# EAGLE design rj11 (EAGLE 7.7.0)
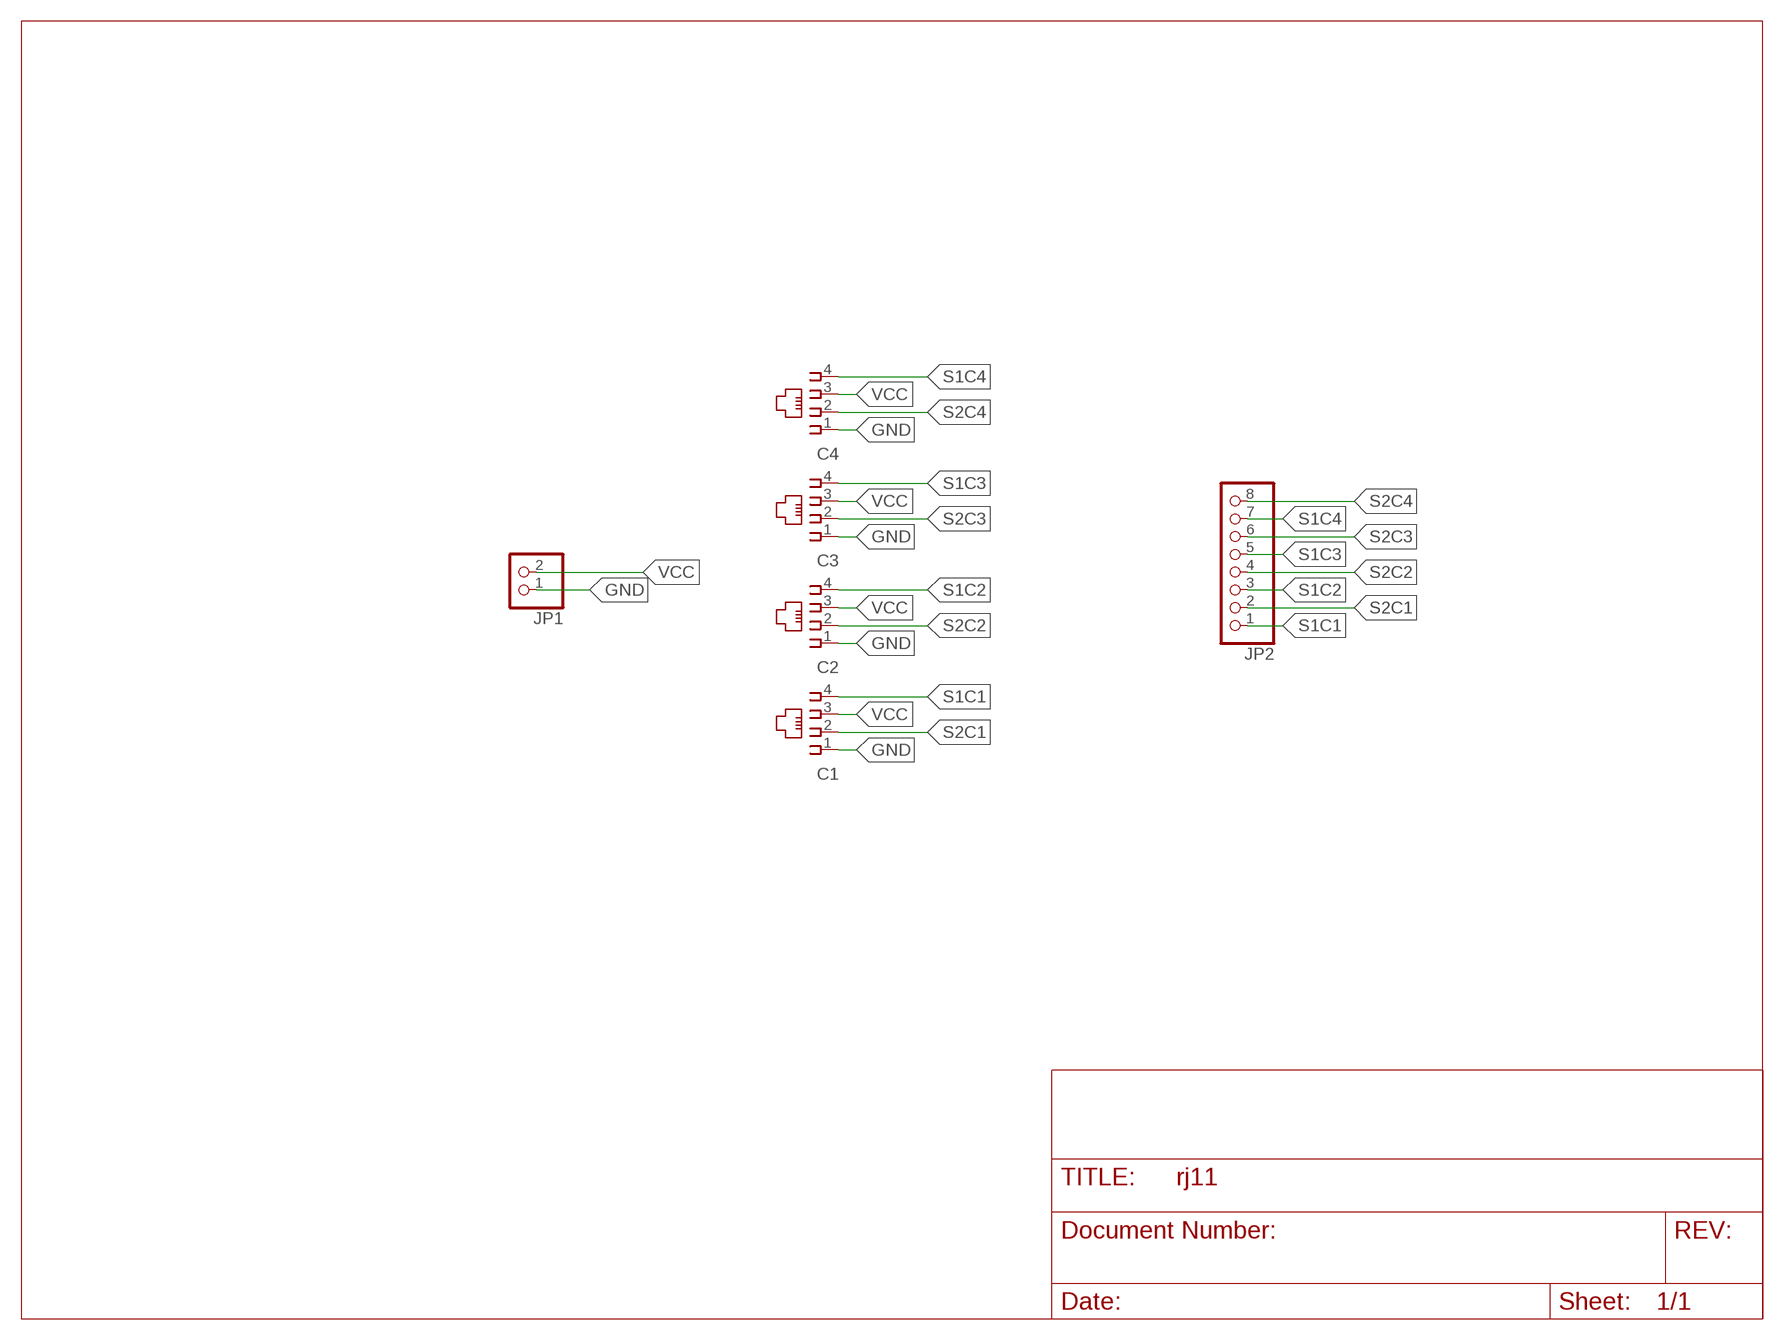
[diagram p0: schematic, sheet 1]

## Parts
C1  14867  [14867]
C2  14867  [14867]
C3  14867  [14867]
C4  14867  [14867]
JP1  PINHD-1X2  [1X02]
JP2  PINHD-1X8  [1X08]

## Nets
GND: C1.1 C2.1 C3.1 C4.1 JP1.1
S1C1: C1.4 JP2.1
S1C2: C2.4 JP2.3
S1C3: C3.4 JP2.5
S1C4: C4.4 JP2.7
S2C1: C1.2 JP2.2
S2C2: C2.2 JP2.4
S2C3: C3.2 JP2.6
S2C4: C4.2 JP2.8
VCC: C1.3 C2.3 C3.3 C4.3 JP1.2

## Library data of the parts
C1-C4 = con-4ucon:14867: RJ11 Connector Source: 4UCON TECHNOLOGY INC. 14867.pdf; OC_FARNELL: unknown; OC_NEWARK: unknown
JP1 = pinhead:PINHD-1X2: PIN HEADER
JP2 = pinhead:PINHD-1X8: PIN HEADER

## Board
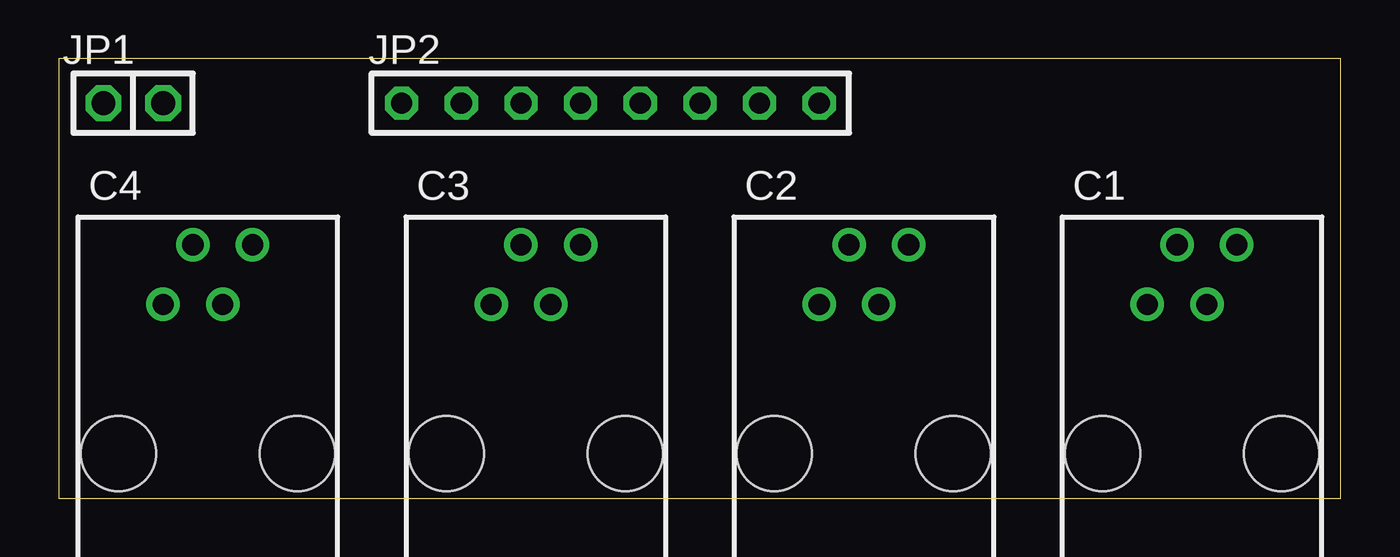
[diagram p1: board, top side]
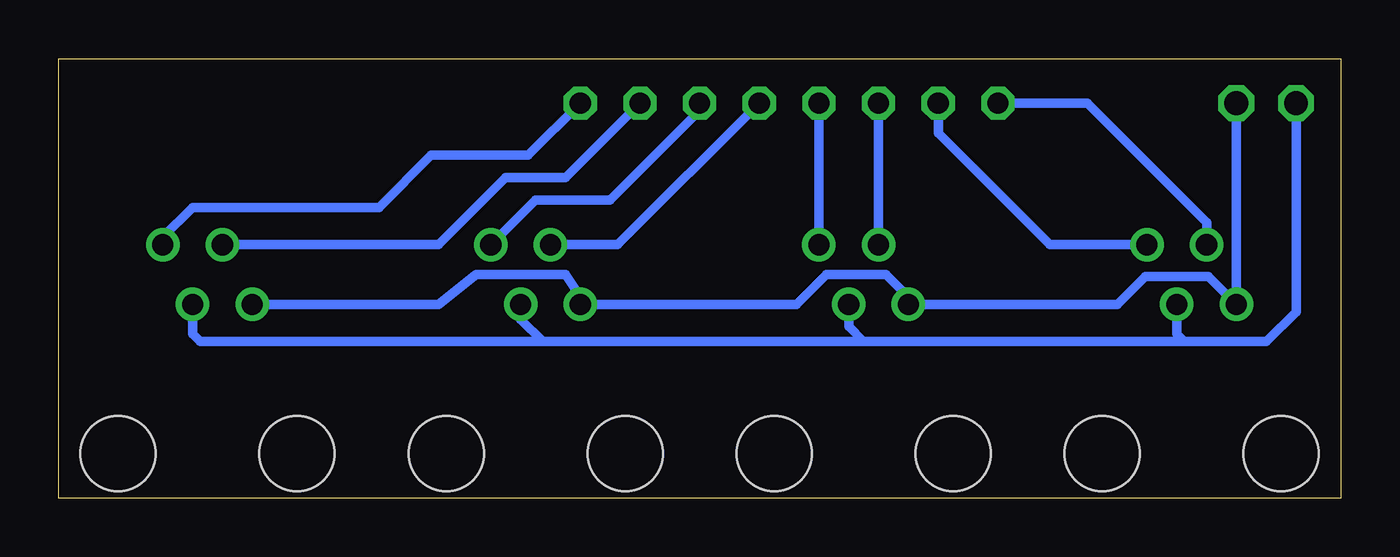
[diagram p2: board, bottom side, seen from below]

Size 54.6 x 18.72 mm. Coordinates in mm from the lower left corner, seen from the top.
Outline: 0,0 54.6,0 54.6,18.72 0,18.72 0,0
Copper layers (1*16): Top 0.035mm / dielectric 1.5mm / Bottom 0.035mm
Design rules "default": minimum track width 10mil, minimum drill 24mil, track to track 8mil, track to pad 8mil, pad to pad 8mil, via to via 8mil, smd to smd 8mil, copper to edge 40mil, drill to drill 8mil, minimum pad ring 10mil, minimum via ring 8mil, stop-mask expansion 4mil, vias tented up to drill 0mil, thermal gap 10mil

### Footprints (pad centres in the part's own frame; a part is rotated, then mirrored left to right if it is on the bottom)
14867 = drill 0.9 pad 1.422: 1 -1.905,6.35; 2 -0.635,8.89; 3 0.635,6.35; 4 1.905,8.89 | hole 3.2: -3.81,0; 3.81,0
1X02 = drill 1.016 octagon: 1 -1.27,0; 2 1.27,0
1X08 = drill 0.9 octagon: 1 -8.89,0; 2 -6.35,0; 3 -3.81,0; 4 -1.27,0; 5 1.27,0; 6 3.81,0; 7 6.35,0; 8 8.89,0

### Placement (x,y rotation side)
C1  48.26,1.91 0 top
C2  34.29,1.91 0 top
C3  20.32,1.91 0 top
C4  6.35,1.91 0 top
JP1  3.17,16.83 180 top
JP2  23.5,16.83 180 top

### Tracks (layer width: path | path; a pad name or v marks a point on that pad's centre or on a via)
GND
  Bottom 0.406: C1.1 38.42,8.26 36.83,9.53 33.02,9.53 32.38,8.57 C2.1 23.18,8.26 21.91,9.53 19.37,9.53 18.5,8.66 18.5,8.34 C3.1 9.53,8.26 8.33,9.45 5.64,9.45 C4.1 JP1.1
S1C1
  Bottom 0.406: JP2.1 34.61,14.61 38.73,14.61 40.96,12.38 48.9,12.38 50.16,11.11 C1.4
S1C2
  Bottom 0.406: C2.4 34.29,12.7 31.11,12.7 27.3,16.51 JP2.3
S1C3
  Bottom 0.406: JP2.5 C3.4
S1C4
  Bottom 0.406: C4.4 12.38,10.79 17.14,15.56 JP2.7
S2C1
  Bottom 0.406: JP2.2 33.02,13.65 35.56,13.65 38.42,10.79 C1.2
S2C2
  Bottom 0.406: JP2.4 30.8,10.79 C2.2
S2C3
  Bottom 0.406: JP2.6 C3.2
S2C4
  Bottom 0.406: JP2.8 10.79,16.83 5.71,11.75 C4.2
VCC
  Bottom 0.406: 6.67,6.67 20.32,6.67 | 20.32,6.67 33.97,6.67 | 33.97,6.67 48.58,6.67 48.9,6.99 C1.3 | C2.3 34.92,7.62 33.97,6.67 | C3.3 20.95,7.3 20.32,6.67 | C4.3 6.99,6.99 6.67,6.67 | 6.67,6.67 3.17,6.67 1.91,7.94 JP1.2